# EAGLE board SmoothieBrainz - next round (EAGLE 6.4), part 1 of 2
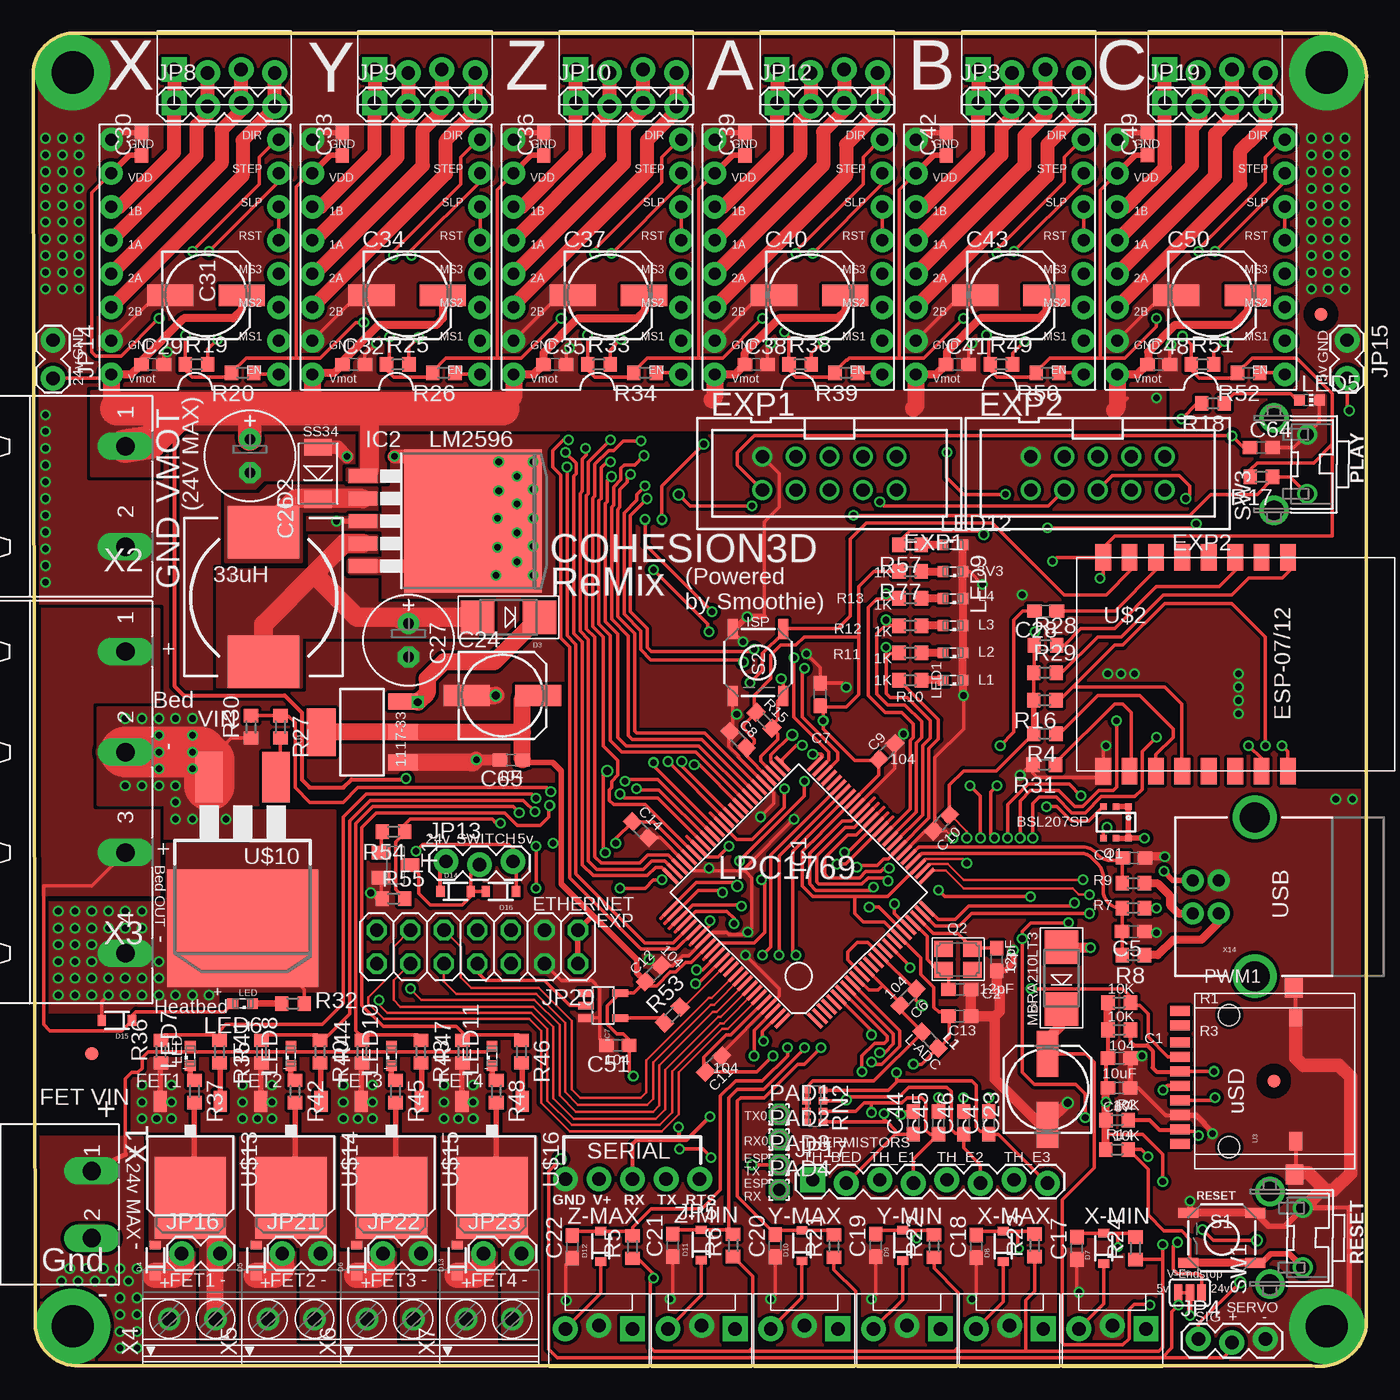
[diagram p3: board, top side]
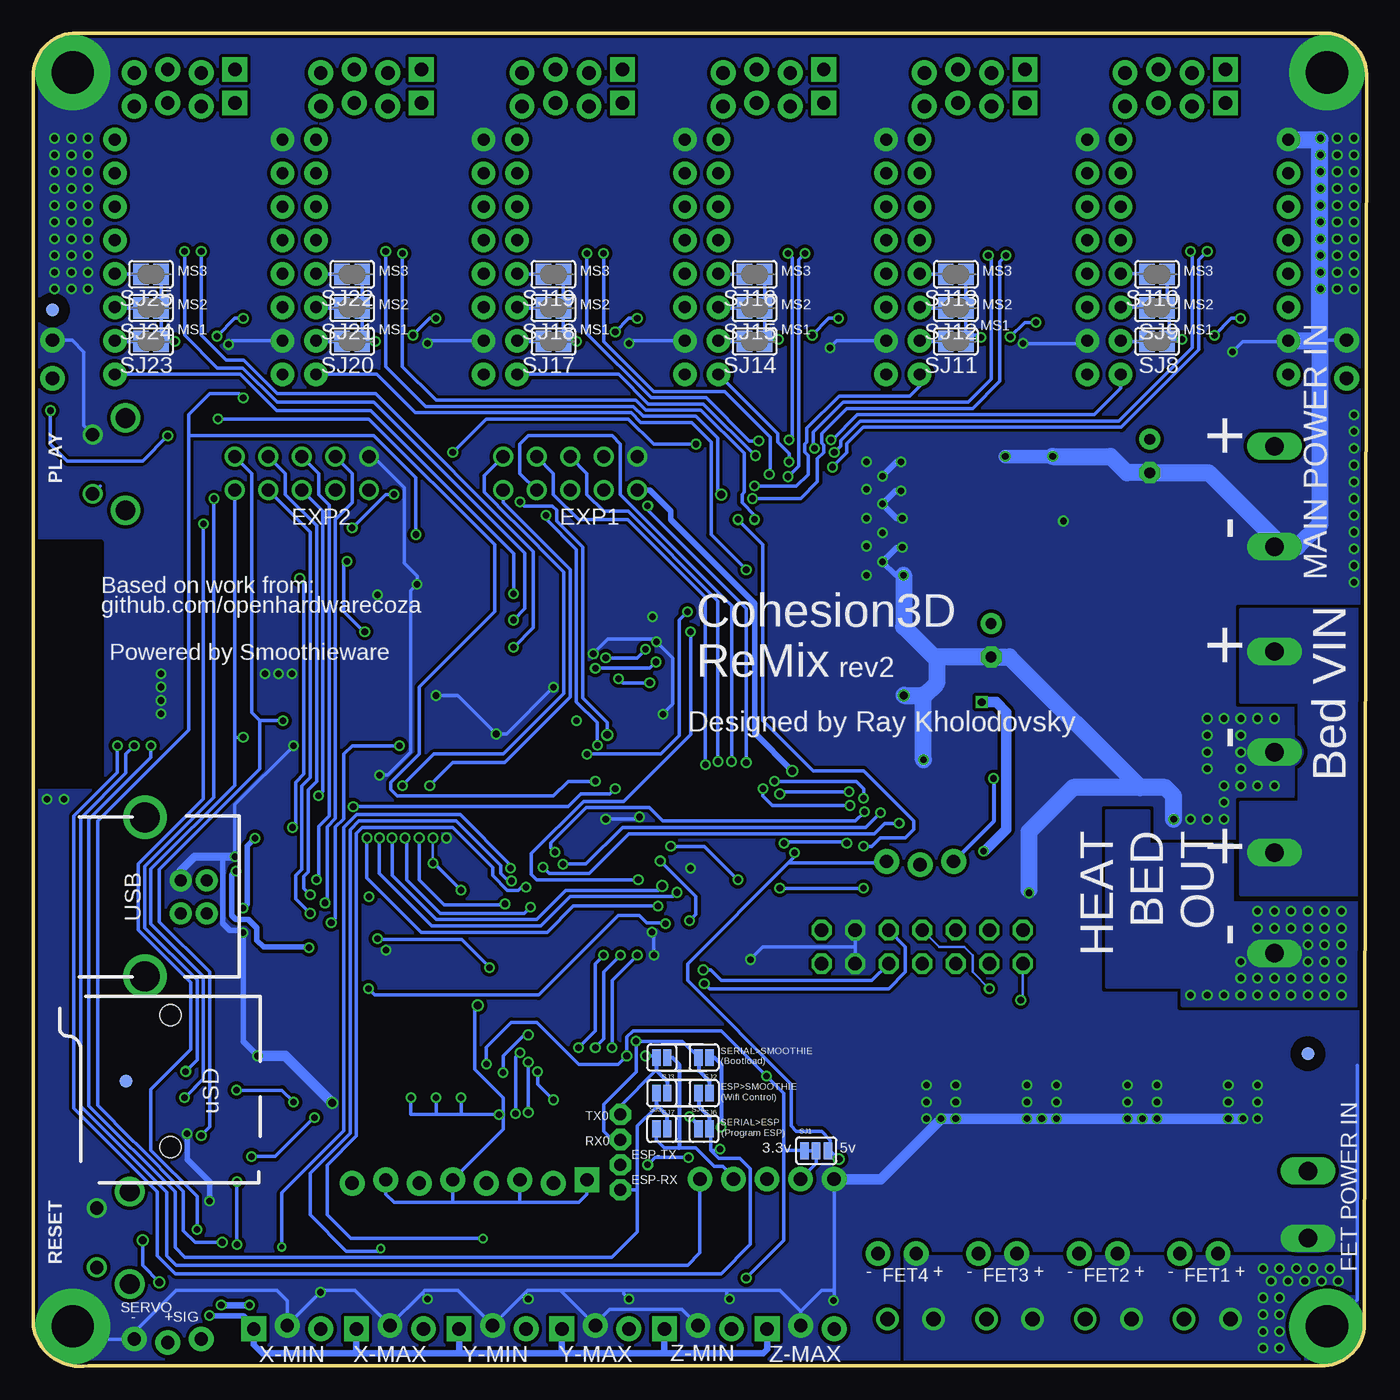
[diagram p4: board, bottom side, seen from below]

Size 101.02 x 101.05 mm. Coordinates in mm from the lower left corner, seen from the top.
Outline: 3.48,0.05 96.85,0.05 arc90 101.01,3.05 101.01,97.48 arc90 98.01,101.05 3.01,101.05 arc90 0.01,97.64 0.16,3.2 arc90 3.48,0.05
Copper layers (1*16): Top 0.035mm / dielectric 1.5mm / Bottom 0.035mm
Design rules "dirt_cheap_dirty_boards.v1 *": minimum track width 5mil, minimum drill 12mil, track to track 8mil, track to pad 5mil, pad to pad 5mil, via to via 5mil, smd to smd 0mil, copper to edge 10mil, drill to drill 10mil, minimum pad ring 10mil, minimum via ring 6mil, stop-mask expansion 2mil, vias tented up to drill 25mil, thermal gap 10mil
Net classes: 1 power: width 0.6 mm, clearance 0.305 mm; 2 ground: width 0.254 mm; 4 30-Amp Class: width 2.54 mm; 5 3.3-Amp Class: width 1.27 mm
tRestrict: area 95.9,44 to 101,62.4
bRestrict: area 95.9,44 to 101,62.4

## Footprints (pad centres in the part's own frame; a part is rotated, then mirrored left to right if it is on the bottom)
C0603 = smd 1.1 x 1: 1 -0.85,0; 2 0.85,0
153CLV-0605 = smd 3.5 x 1.6: + 2.7,0; - -2.7,0
E2,5-7 = drill 0.813 pad 1.6: + -1.27,0 | drill 0.813 pad 1.6 octagon: - 1.27,0
SMADIODE = smd 2.54 x 2.54: A 2.349,0; C -2.349,0
DO-214AC = smd 1.27 x 2.1: 1 -1.98,0; 2 1.98,0
SOD-323 = smd 0.63 x 0.83: A 1.15,0; C -1.15,0
PAK100/2500-10 = drill 1 pad 1.422: 1 -5.08,-1.27; 2 -5.08,1.27; 3 -2.54,-1.27; 4 -2.54,1.27; 5 0,-1.27; 6 0,1.27; 7 2.54,-1.27; 8 2.54,1.27; 9 5.08,-1.27; 10 5.08,1.27
LQFP100 = smd 0.27 x 1.5: 1 -6,-7.75; 2 -5.5,-7.75; 3 -5,-7.75; 4 -4.5,-7.75; 5 -4,-7.75; 6 -3.5,-7.75; 7 -3,-7.75; 8 -2.5,-7.75; 9 -2,-7.75; 10 -1.5,-7.75; 11 -1,-7.75; 12 -0.5,-7.75; 13 0,-7.75; 14 0.5,-7.75; 15 1,-7.75; 16 1.5,-7.75; 17 2,-7.75; 18 2.5,-7.75; 19 3,-7.75; 20 3.5,-7.75; 21 4,-7.75; 22 4.5,-7.75; 23 5,-7.75; 24 5.5,-7.75; 25 6,-7.75; 51 6,7.75; 52 5.5,7.75; 53 5,7.75; 54 4.5,7.75; 55 4,7.75; 56 3.5,7.75; 57 3,7.75; 58 2.5,7.75; 59 2,7.75; 60 1.5,7.75; 61 1,7.75; 62 0.5,7.75; 63 0,7.75; 64 -0.5,7.75; 65 -1,7.75; 66 -1.5,7.75; 67 -2,7.75; 68 -2.5,7.75; 69 -3,7.75; 70 -3.5,7.75; 71 -4,7.75; 72 -4.5,7.75; 73 -5,7.75; 74 -5.5,7.75; 75 -6,7.75 | smd 1.5 x 0.27: 26 7.75,-6; 27 7.75,-5.5; 28 7.75,-5; 29 7.75,-4.5; 30 7.75,-4; 31 7.75,-3.5; 32 7.75,-3; 33 7.75,-2.5; 34 7.75,-2; 35 7.75,-1.5; 36 7.75,-1; 37 7.75,-0.5; 38 7.75,0; 39 7.75,0.5; 40 7.75,1; 41 7.75,1.5; 42 7.75,2; 43 7.75,2.5; 44 7.75,3; 45 7.75,3.5; 46 7.75,4; 47 7.75,4.5; 48 7.75,5; 49 7.75,5.5; 50 7.75,6; 76 -7.75,6; 77 -7.75,5.5; 78 -7.75,5; 79 -7.75,4.5; 80 -7.75,4; 81 -7.75,3.5; 82 -7.75,3; 83 -7.75,2.5; 84 -7.75,2; 85 -7.75,1.5; 86 -7.75,1; 87 -7.75,0.5; 88 -7.75,0; 89 -7.75,-0.5; 90 -7.75,-1; 91 -7.75,-1.5; 92 -7.75,-2; 93 -7.75,-2.5; 94 -7.75,-3; 95 -7.75,-3.5; 96 -7.75,-4; 97 -7.75,-4.5; 98 -7.75,-5; 99 -7.75,-5.5; 100 -7.75,-6
TO263-5 = smd 1.067 x 2.159: 1 -3.404,-5.791; 2 -1.702,-5.791; 3 0,-5.791; 4 1.702,-5.791; 5 3.404,-5.791 | smd 10.8 x 10.41: 6 0,2.54
SOT23-5 = smd 0.55 x 1.2: 1 -0.95,-1.3; 2 0,-1.3; 3 0.95,-1.3; 4 0.95,1.3; 5 -0.95,1.3
MOLEX-1X4_LOCK = drill 1.016 pad 1.88 square: 1 0,0.127 | drill 1.016 pad 1.88: 2 2.54,-0.127; 3 5.08,0.127; 4 7.62,-0.127
1X04_LOCK = drill 1.016 pad 1.88 square: 1 0,0.127 | drill 1.016 pad 1.88: 2 2.54,-0.127; 3 5.08,0.127; 4 7.62,-0.127
1X03_LOCK = drill 1.016 pad 1.88: 1 0,0.127; 2 2.54,-0.127; 3 5.08,0.127
1X05_NO_SILK = drill 1.016 pad 1.88: 1 0,0; 2 2.54,0; 3 5.08,0; 4 7.62,0; 5 10.16,0
1X02_LOCK = drill 1.016 pad 1.88: 1 -0.178,0; 2 2.718,0
1X08_LOCK = drill 1.016 pad 1.88 square: 1 0,0.127 | drill 1.016 pad 1.88: 2 2.54,-0.127; 3 5.08,0.127; 4 7.62,-0.127; 5 10.16,0.127; 6 12.7,-0.127; 7 15.24,0.127; 8 17.78,-0.127
2X07 = drill 1.016 octagon: 1 -7.62,-1.27; 2 -7.62,1.27; 3 -5.08,-1.27; 4 -5.08,1.27; 5 -2.54,-1.27; 6 -2.54,1.27; 7 0,-1.27; 8 0,1.27; 9 2.54,-1.27; 10 2.54,1.27; 11 5.08,-1.27; 12 5.08,1.27; 13 7.62,-1.27; 14 7.62,1.27
0603 = smd 1.1 x 1: 1 -0.85,0; 2 0.85,0
CDRH125 = smd 5.4 x 4: 1 0,4.9; 2 0,-4.9
SML0603 = smd 0.8 x 0.8: A 0.75,0; C -0.75,0
CHIP-LED0603 = smd 0.8 x 0.8: A 0,-0.75; C 0,0.75
1,6/0,9 = drill 0.914 pad 1.6 octagon: 1 0,0
SC74_INFINEON = smd 0.5 x 0.5: 1 -0.95,-1.2; 2 0,-1.2; 3 0.95,-1.2; 4 0.95,1.2; 5 0,1.2; 6 -0.95,1.2
CRYSTAL_3.2X2.5 = smd 1.4 x 1.2: 1 -1.1,-0.8; 2 1.1,0.8; GND1 -1.1,0.8; GND2 1.1,-0.8
R0603 = smd 1 x 1.1: 1 -0.85,0; 2 0.85,0
0603-ARV = smd 0.5 x 0.65: 1 -1.2,-0.625; 2 -0.4,-0.625; 3 0.4,-0.625; 4 1.2,-0.625; 5 1.2,0.625; 6 0.4,0.625; 7 -0.4,0.625; 8 -1.2,0.625
TACTILE_SWITCH_SMD = smd 1.524 x 0.762: 1 -2.54,1.905; 2 2.54,1.905; 3 -2.54,-1.905; 4 2.54,-1.905
SJ_3 = smd 0.635 x 1.27: 1 -0.889,0; 2 0,0; 3 0.889,0
SJ_2S = smd 0.635 x 1.27: 1 -0.412,0; 2 0.412,0
SJ = smd 1.168 x 1.6: 1 -0.762,0; 2 0.762,0
SW_TACT_STANDARD_RIGHT_ANGLE = drill 1: 1 -2.25,0; 2 2.25,0 | drill 1.5: 3 -3.5,2.5; 4 3.5,2.5
SOT23-BEC = smd 1 x 1.4: B -0.95,-1.1; C 0,1.1; E 0.95,-1.1
SOT223 = smd 1.219 x 2.235: 1 -2.311,-3.099; 2 0,-3.099; 3 2.311,-3.099 | smd 3.6 x 2.2: 4 0,3.099
USD-SOCKET-PP = smd 0.75 x 1.5: 1 2.925,1.125; 2 1.825,1.125; 3 0.725,1.125; 4 -0.375,1.125; 5 -1.475,1.125; 6 -2.575,1.125; 7 -3.675,1.125; 8 -4.775,1.125; CD1 5.325,1.125; CD2 4.225,1.125 | smd 1.4 x 1: CDNC1 -4.55,-7.65 | smd 1.3 x 1: CDNC2 4.775,-7.65 | smd 1.5 x 1.35: GND1 -7.075,-7.55; GND2 7.075,-7.5 | hole 1.6: -5,-2.6; 5,-2.6
A4988BREAKOUT = drill 0.9 pad 1.778: 1A 8.89,1.27; 1B 11.43,1.27; 2A 6.35,1.27; 2B 3.81,1.27; DIR 16.51,-11.43; EN -1.27,-11.43; GND 16.51,1.27; GND@0 1.27,1.27; MS1 1.27,-11.43; MS2 3.81,-11.43; MS3 6.35,-11.43; RST 8.89,-11.43; SLP 11.43,-11.43; STEP 13.97,-11.43; VDD 13.97,1.27; VMOT -1.27,1.27
ESP8266-ESP12 = smd 2 x 1.2: 1 16.2,2; 2 16.2,4; 3 16.2,6; 4 16.2,8; 5 16.2,10; 6 16.2,12; 7 16.2,14; 8 16.2,16; 9 0,16; 10 0,14; 11 0,12; 12 0,10; 13 0,8; 14 0,6; 15 0,4; 16 0,2
D2PACK = smd 2.083 x 3.81: 1 -2.54,-8.89; 3 2.54,-8.89 | smd 11.43 x 8.89: 2 0,2.54
FIDUCIAL_1MM = smd 1 x 1: 1 0,0
D-PAK_TO252AA = smd 1 x 1.6: 1 -2.28,-4.8; 3 2.28,-4.8 | smd 5.4 x 6.2: 4 0,2.5
MSTBA2 = drill 1.397 long: 1 -2.54,5.08; 2 2.54,5.08
GMSTBA2 = drill 1.397 long: 1 -3.81,5.08; 2 3.81,5.08
GMSTBA4 = drill 1.397 long: 1 -11.43,5.08; 2 -3.81,5.08; 3 3.81,5.08; 4 11.43,5.08
1751248 = drill 1.1 pad 1.7: 1 -1.75,-0.1; 2 1.75,-0.1
USB-B-PTH = drill 0.914 pad 1.676: D+ 0,1.25; D- 1.981,1.25; GND 0,-1.25; VBUS 1.981,-1.25 | drill 2.286: S1 -2.718,-6.02; S2 -2.718,6.02
MOLEX-1X3_LOCK = drill 1.016 pad 1.88 square: 1 0,0.127 | drill 1.016 pad 1.88: 2 2.54,-0.127; 3 5.08,0.127

## Placement (x,y rotation side)
C1  .1uF  [C0603]  82.29,23.37 180 top
C2  12pF  [C0603]  70.2,28.57 0 top
C3  12pF  [C0603]  72.99,30.85 270 top
C4  18pF  [C0603]  83.4,38.55 180 top
C5  18pF  [C0603]  83.35,32.96 180 top
C6  .1uF  [C0603]  66.28,27.97 45 top
C7  10uF  [C0603]  59.63,50.93 90 top
C8  104  [C0603]  53.41,47.51 315 top
C9  104  [C0603]  64.67,46.6 225 top
C10  104  [C0603]  68.82,41.18 45 top
C11  .1uF  [C0603]  51.56,22.93 225 top
C12  .1uF  [C0603]  46.98,29.77 225 top
C13  104  [C0603]  70.19,26.55 180 top
C14  104  [C0603]  46.02,40.67 135 top
C17  104  [C0603]  79.07,8.97 90 top
C18  104  [C0603]  71.45,9.11 90 top
C19  104  [C0603]  63.83,9.18 90 top
C20  104  [C0603]  56.21,9.16 90 top
C21  104  [C0603]  48.47,9.19 90 top
C22  104  [C0603]  40.85,9.06 90 top
C23  100u  [153CLV-0605]  76.84,21 90 top
C24  100u  [153CLV-0605]  35.57,50.85 0 top
C26  220u  [E2,5-7]  16.43,68.99 270 top
C27  220u  [E2,5-7]  28.44,55.03 270 top
C28  104  [C0603]  76.7,57.24 180 top
C29  104  [C0603]  9.05,75.93 0 top
C30  104  [C0603]  8.21,92.63 90 top
C31  100uF  [153CLV-0605]  13.1,81.17 0 top
C32  104  [C0603]  24.29,75.93 0 top
C33  104  [C0603]  23.42,92.63 90 top
C34  100uF  [153CLV-0605]  28.34,81.17 0 top
C35  104  [C0603]  39.53,75.93 0 top
C36  104  [C0603]  38.69,92.63 90 top
C37  100uF  [153CLV-0605]  43.58,81.17 0 top
C38  104  [C0603]  54.77,75.93 0 top
C39  104  [C0603]  53.93,92.63 90 top
C40  100uF  [153CLV-0605]  58.82,81.17 0 top
C41  104  [C0603]  70.01,75.93 0 top
C42  104  [C0603]  69.17,92.63 90 top
C43  100uF  [153CLV-0605]  74.06,81.17 0 top
C44  10uF  [C0603]  66.68,18.46 90 top
C45  10uF  [C0603]  68.59,18.46 90 top
C46  10uF  [C0603]  70.49,18.46 90 top
C47  10uF  [C0603]  72.4,18.46 90 top
C48  104  [C0603]  85.25,75.93 0 top
C49  104  [C0603]  84.41,92.64 90 top
C50  100uF  [153CLV-0605]  89.3,81.17 0 top
C51  .1uF  [C0603]  44.3,24.33 180 top
C64  10uF  [C0603]  93.03,69.62 0 top
C65  .1uF  [C0603]  36.21,45.97 180 top
C67  10uF  [C0603]  82.26,21.11 180 top
D1  MBRA210LT3  [SMADIODE]  77.91,29.43 90 top
D2  [DO-214AC]  21.6,67.67 90 top
D3  MBRA210LT3  [SMADIODE]  36.02,56.77 180 top
D4  1N4148  [SOD-323]  9.28,8.05 90 top
D5  1N4148  [SOD-323]  16.9,8.05 90 top
D6  1N4148  [SOD-323]  24.52,8.05 90 top
D7  1N4148  [SOD-323]  81.11,8.95 90 top
D8  1N4148  [SOD-323]  73.49,9.11 90 top
D9  1N4148  [SOD-323]  65.87,9.18 90 top
D10  1N4148  [SOD-323]  58.25,9.16 90 top
D11  1N4148  [SOD-323]  50.63,9.21 90 top
D12  1N4148  [SOD-323]  43.01,9.11 90 top
D13  1N4148  [SOD-323]  32.14,8.05 90 top
D14  1N4148  [SOD-323]  32.01,35.99 0 top
D15  1N4148  [SOD-323]  6.36,26.24 180 top
D16  1N4148  [SOD-323]  35.44,35.99 180 top
EXP1  2510-  [PAK100/2500-10]  60.33,67.67 180 top
EXP2  2510-  [PAK100/2500-10]  80.65,67.67 180 top
IC1  LPC1769  [LQFP100]  58.01,35.93 45 top
IC2  [TO263-5]  30.78,64.06 270 top
IC7  74LVC1G04  [SOT23-5]  43.19,27.35 270 top
JP1  [MOLEX-1X4_LOCK]  71.6,98.15 0 top
JP2  [MOLEX-1X4_LOCK]  25.88,98.15 0 top
JP3  [1X04_LOCK]  71.6,95.61 0 top
JP4  [1X03_LOCK]  88.27,1.95 0 top
JP5  [1X05_NO_SILK]  50.5,14.2 180 top
JP6  [MOLEX-1X4_LOCK]  10.69,98.15 0 top
JP7  [MOLEX-1X4_LOCK]  41.12,98.15 0 top
JP8  [1X04_LOCK]  10.69,95.61 0 top
JP9  [1X04_LOCK]  25.88,95.61 0 top
JP10  [1X04_LOCK]  41.12,95.61 0 top
JP11  [MOLEX-1X4_LOCK]  56.36,98.15 0 top
JP12  [1X04_LOCK]  56.36,95.61 0 top
JP13  [1X03_LOCK]  31.28,38.15 0 top
JP14  [1X02_LOCK]  1.51,77.59 270 top
JP15  [1X02_LOCK]  99.54,77.59 270 top
JP16  [1X02_LOCK]  11.44,8.55 0 top
JP17  [1X08_LOCK]  59.06,14.02 0 top
JP18  [MOLEX-1X4_LOCK]  85.73,98.15 0 top
JP19  [1X04_LOCK]  85.73,95.61 0 top
JP20  [2X07]  33.66,31.8 180 top
JP21  [1X02_LOCK]  19.06,8.55 0 top
JP22  [1X02_LOCK]  26.68,8.55 0 top
JP23  [1X02_LOCK]  34.3,8.55 0 top
L1  39nH  [0603]  67.94,24.75 315 top
L2  33uH  [CDRH125]  17.46,58.31 0 top
LED1  [SML0603]  69.68,52 180 top
LED2  [SML0603]  69.68,54.08 180 top
LED3  [SML0603]  69.68,56.15 180 top
LED4  [SML0603]  69.68,58.19 180 top
LED5  [CHIP-LED0603]  96.68,73.23 270 top
LED6  [SML0603]  15.88,27.51 180 top
LED7  [SML0603]  11.91,23.54 90 top
LED8  LED  [SML0603]  19.53,23.54 90 top
LED9  [SML0603]  69.69,60.24 180 top
LED10  LED  [SML0603]  27.15,23.54 90 top
LED11  LED  [SML0603]  34.77,23.54 90 top
LED12  VMOT  [SML0603]  69.69,62.28 0 top
PAD1  [1,6/0,9]  56.52,19.1 0 top
PAD2  [1,6/0,9]  56.52,17.19 0 top
PAD3  [1,6/0,9]  56.52,15.29 0 top
PAD4  [1,6/0,9]  56.52,13.38 0 top
Q1  BSL207SP  [SC74_INFINEON]  82.02,41.23 180 top
Q2  12MHz  [CRYSTAL_3.2X2.5]  70.07,30.85 180 top
R1  10K  [R0603]  82.28,27.59 180 top
R2  10K  [R0603]  82.12,18.68 180 top
R3  10K  [R0603]  82.28,25.51 180 top
R4  10K  [R0603]  76.65,47.95 180 top
R5  10k  [R0603]  45.4,9.06 90 top
R6  10k  [R0603]  53.04,9.18 90 top
R7  1.5K  [R0603]  83.35,34.75 0 top
R8  33R  [R0603]  83.35,31.17 180 top
R9  33R  [R0603]  83.35,36.63 180 top
R10  [R0603]  66.44,52 180 top
R11  [R0603]  66.44,54.08 180 top
R12  [R0603]  66.44,56.15 180 top
R13  [R0603]  66.44,58.19 180 top
R14  10K  [R0603]  82.12,16.44 180 top
R15  10K  [R0603]  55.37,48.97 135 top
R16  10K  [R0603]  76.65,50.5 180 top
R17  10K  [R0603]  93.05,67.4 180 top
R18  1k  [R0603]  89.38,72.99 180 top
R19  1k  [R0603]  12.39,75.93 0 top
R20  10k  [R0603]  15.88,75.29 180 top
R21  10k  [R0603]  60.66,9.13 90 top
R22  10k  [R0603]  68.26,9.12 90 top
R23  10k  [R0603]  75.88,9.18 90 top
R24  10k  [R0603]  83.5,8.96 90 top
R25  1k  [R0603]  27.63,75.93 0 top
R26  10k  [R0603]  31.12,75.29 180 top
R27  10r  [R0603]  18.74,48.46 270 top
R28  10K  [R0603]  76.7,54.64 0 top
R29  10K  [R0603]  76.66,52.58 0 top
R30  100k  [R0603]  16.52,48.46 90 top
R31  10K  [R0603]  76.6,45.6 180 top
R32  1.5k  [R0603]  19.69,27.51 0 top
R33  1k  [R0603]  42.87,75.93 0 top
R34  10k  [R0603]  46.36,75.29 180 top
R35  10r  [R0603]  14.13,23.86 270 top
R36  100k  [R0603]  9.69,23.86 90 top
R37  1.5k  [R0603]  12.23,20.84 270 top
R38  1k  [R0603]  58.11,75.93 0 top
R39  10k  [R0603]  61.6,75.29 180 top
R40  10r  [R0603]  21.75,23.86 270 top
R41  100k  [R0603]  17.31,23.86 90 top
R42  1.5k  [R0603]  19.85,20.84 270 top
R43  10r  [R0603]  29.37,23.86 270 top
R44  100k  [R0603]  24.93,23.86 90 top
R45  1.5k  [R0603]  27.47,20.84 270 top
R46  10r  [R0603]  36.99,23.86 270 top
R47  100k  [R0603]  32.55,23.86 90 top
R48  1.5k  [R0603]  35.09,20.84 270 top
R49  1k  [R0603]  73.35,75.93 0 top
R50  10k  [R0603]  76.84,75.29 180 top
R51  1k  [R0603]  88.59,75.93 0 top
R52  10k  [R0603]  92.08,75.29 180 top
R53  22R  [R0603]  48.42,26.64 45 top
R54  10r  [R0603]  27.31,40.53 180 top
R55  100k  [R0603]  27.31,35.45 0 top
R57  1.5k  [R0603]  66.44,62.28 180 top
R77  [R0603]  66.44,60.24 180 top
RN2  4k7  [0603-ARV]  59.22,19.73 90 top
S1  [TACTILE_SWITCH_SMD]  90.05,9.76 180 top
S2  [TACTILE_SWITCH_SMD]  54.91,53.35 270 top
SJ1  [SJ_3]  41.69,16.35 0 bottom
SJ2  [SJ_2S]  50.19,23.41 180 bottom
SJ3  [SJ_2S]  53.39,23.41 180 bottom
SJ4  [SJ_2S]  50.19,18.01 0 bottom
SJ5  [SJ_2S]  53.39,18.01 0 bottom
SJ6  [SJ_2S]  50.19,20.71 180 bottom
SJ7  [SJ_2S]  53.39,20.71 180 bottom
SJ8  [SJ]  15.88,77.67 180 bottom
SJ9  [SJ]  15.88,80.21 180 bottom
SJ10  [SJ]  15.88,82.75 180 bottom
SJ11  [SJ]  31.12,77.67 180 bottom
SJ12  [SJ]  31.12,80.21 180 bottom
SJ13  [SJ]  31.12,82.75 180 bottom
SJ14  [SJ]  46.36,77.67 180 bottom
SJ15  [SJ]  46.36,80.21 180 bottom
SJ16  [SJ]  46.36,82.75 180 bottom
SJ17  [SJ]  61.6,77.67 180 bottom
SJ18  [SJ]  61.6,80.21 180 bottom
SJ19  [SJ]  61.6,82.75 180 bottom
SJ20  [SJ]  76.84,77.67 180 bottom
SJ21  [SJ]  76.84,80.21 180 bottom
SJ22  [SJ]  76.84,82.75 180 bottom
SJ23  [SJ]  92.08,77.67 180 bottom
SJ24  [SJ]  92.08,80.21 180 bottom
SJ25  [SJ]  92.08,82.75 180 bottom
SJ26  [SJ_3]  87.64,5.6 0 top
SW1  SW_TACT_4P_B  [SW_TACT_STANDARD_RIGHT_ANGLE]  96.19,9.75 90 top
SW3  SW_TACT_4P_B  [SW_TACT_STANDARD_RIGHT_ANGLE]  96.51,68.37 90 top
T1  BC817  [SOT23-BEC]  27.47,37.99 270 top
U1  [SOT223]  24.93,48.07 90 top
U3  USD-SOCKETUSD  [USD-SOCKET-PP]  88.01,21.63 90 top
U$1  POLOLU_A4983CARRIER  [A4988BREAKOUT]  7.2,76.45 90 top
U$2  ESP8266_ESP-12  [ESP8266-ESP12]  79.06,61.31 270 top
U$5  POLOLU_A4983CARRIER  [A4988BREAKOUT]  22.43,76.45 90 top
U$6  POLOLU_A4983CARRIER  [A4988BREAKOUT]  37.67,76.45 90 top
U$7  POLOLU_A4983CARRIER  [A4988BREAKOUT]  52.91,76.45 90 top
U$8  POLOLU_A4983CARRIER  [A4988BREAKOUT]  68.15,76.45 90 top
U$9  POLOLU_A4983CARRIER  [A4988BREAKOUT]  83.39,76.45 90 top
U$10  SUM120N04-1M7L-GE3  [D2PACK]  15.88,35.76 180 top
U$11  FIDUCIAL  [FIDUCIAL_1MM]  93.99,21.64 0 top
U$12  FIDUCIAL  [FIDUCIAL_1MM]  97.56,79.74 0 top
U$13  IRLR024  [D-PAK_TO252AA]  11.91,15.29 180 top
U$14  IRLR024  [D-PAK_TO252AA]  19.53,15.29 180 top
U$15  IRLR024  [D-PAK_TO252AA]  27.15,15.29 180 top
U$16  IRLR024  [D-PAK_TO252AA]  34.77,15.29 180 top
U$17  FIDUCIAL  [FIDUCIAL_1MM]  4.45,23.7 0 top
U$18  FIDUCIAL  [FIDUCIAL_1MM]  99.54,80.06 0 bottom
U$19  FIDUCIAL  [FIDUCIAL_1MM]  93.99,21.64 0 bottom
U$20  FIDUCIAL  [FIDUCIAL_1MM]  4.45,23.7 0 bottom
X1  MSTBA2  [MSTBA2]  -0.63,12.27 270 top
X2  GMSTBA2  [GMSTBA2]  1.91,65.93 270 top
X3  GMSTBA4  [GMSTBA4]  1.91,42.75 270 top
X4  1751248  [1751248]  12.07,3.7 0 top
X5  1751248  [1751248]  19.56,3.7 0 top
X6  1751248  [1751248]  27.06,3.7 0 top
X7  1751248  [1751248]  34.55,3.7 0 top
X14  USBPTH  [USB-B-PTH]  89.83,35.59 180 top
XMN  [MOLEX-1X3_LOCK]  84.3,2.98 180 top
XMX  [MOLEX-1X3_LOCK]  76.52,2.98 180 top
YMN  [MOLEX-1X3_LOCK]  68.74,2.98 180 top
YMX  [MOLEX-1X3_LOCK]  60.96,2.98 180 top
ZMN  [MOLEX-1X3_LOCK]  53.18,2.98 180 top
ZMX  [MOLEX-1X3_LOCK]  45.41,2.98 180 top

## Tracks (layer width: path | path; a pad name or v marks a point on that pad's centre or on a via)
1A1M
  Top 1.016: JP8.2 13.23,94.87
  Top 1.067: 13.23,94.87 12.39,94.03 12.39,91.8 U$1.1A | JP8.2 JP6.2
1A2M
  Top 1.067: JP2.2 JP9.2 28.42,94.85 27.63,94.06 27.63,91.64 21.33,85.34 U$5.1A
1A3M
  Top 1.016: 43.66,94.98 JP10.2
  Top 1.067: JP7.2 JP10.2 | 43.66,94.98 42.87,94.18 42.87,91.81 U$6.1A
1A$4M
  Top 1.016: 58.11,94.34 59.06,95.3 59.06,95.33 JP12.2
  Top 1.067: 58.11,94.34 58.11,91.81 U$7.1A | JP11.2 JP12.2
1A$5M
  Top 1.067: U$8.1A 73.35,91.81 73.35,93.87 74.14,94.66 JP3.2 JP1.2
1A$6M
  Top 0.254: JP19.2 88.43,95.49 88.43,94.66
  Top 1.067: JP18.2 JP19.2 | 88.43,96.6 88.43,94.66 88.43,94.5 87.79,93.87 87.79,91.01 U$9.1A
1B1M
  Top 1.067: JP6.1 JP8.1 10.69,92.01 6.56,87.88 U$1.1B
1B2M
  Top 1.067: JP2.1 JP9.1 25.88,91.96 21.8,87.88 U$5.1B
1B3M
  Top 1.067: JP7.1 JP10.1 41.12,91.96 37.04,87.88 U$6.1B
1B$4M
  Top 1.067: JP11.1 JP12.1 56.36,91.96 52.28,87.88 U$7.1B
1B$5M
  Top 1.067: JP1.1 JP3.1 71.6,91.96 67.52,87.88 U$8.1B
1B$6M
  Top 1.067: JP18.1 JP19.1 85.73,90.85 83.51,88.63 83.19,88.31 82.76,87.88 U$9.1B
2
  Top 0.254: R4.1 77.75,47.95 80.65,50.85 83.83,50.85 86.37,48.31 86.37,47.67 85.06,46.37 U$2.3
2A1M
  Top 1.016: JP8.3 15.77,95.18
  Top 1.067: U$1.2A 14.29,91.17 14.29,93.71 15.77,95.18 | JP8.3 JP6.3
2A2M
  Top 1.067: U$5.2A 21.33,82.8 29.53,91.01 29.53,93.71 30.96,95.14 JP9.3 JP2.3
2A3M
  Top 1.016: 46.04,95.14 46.04,95.58 JP10.3
  Top 1.067: 36.41,82.8 44.77,91.17 44.77,93.87 46.04,95.14 | JP7.3 JP10.3
  Top 1.27: U$6.2A 36.41,82.8
2A$4M
  Top 1.016: 59.85,93.55 61.6,95.3 61.6,95.58 JP12.3
  Top 1.067: 59.85,93.55 59.85,91.02 U$7.2A | JP11.3 JP12.3
2A$5M
  Top 1.067: U$8.2A 75.09,91.02 75.09,93.23 76.68,94.82 JP3.3 JP1.3
2A$6M
  Top 1.067: U$9.2A 89.54,90.22 89.54,93.39 90.49,94.34 90.81,94.66 JP19.3 JP18.3
  Top 1.27: U$9.2A
2B1M
  Top 1.067: 18.26,95.3 15.88,92.91 15.88,90.22 U$1.2B | JP8.4 JP6.4
  Top 1.27: JP8.4 18.31,95.41 18.42,95.3 18.26,95.3
2B2M
  Top 1.067: JP2.4 JP9.4 | 33.5,95.14 31.28,92.91 31.28,90.37 21.17,80.26 U$5.2B
  Top 1.27: JP9.4 33.5,95.14
2B3M
  Top 1.016: JP10.4 48.74,95.14
  Top 1.067: 36.4,80.41 46.52,90.53 46.52,92.91 48.74,95.14 | JP7.4 JP10.4
  Top 1.27: U$6.2B 36.4,80.41
2B$4M
  Top 1.016: 63.9,94.9 63.9,95.41
  Top 1.067: 63.9,94.9 61.6,92.6 61.6,90.22 U$7.2B | JP11.4 JP12.4 63.9,95.41
2B$5M
  Top 1.067: U$8.2B 76.84,90.22 76.84,92.6 79.22,94.98 JP3.4 JP1.4
2B$6M
  Top 1.067: U$9.2B 91.45,89.58 91.45,92.12 92.72,93.39 93.35,94.03 JP19.4 JP18.4
  Top 1.27: U$9.2B
3.3V  (via drill 0.5)
  Top 0.203: IC1.28 67.59,38.45 70.42,38.45 v70.73,38.15 | v70.73,40.05 70.73,40.55 69.5,41.78 C10.2
  Top 0.254: C13.2 69.18,26.86 | 69.18,26.86 68.59,26.86 68.23,27.23 68.23,28.73 67.23,29.73 67.23,30.95 IC1.19 64.48,33.7 62.87,33.7 62.24,34.34 62.24,35.61 | 69.18,26.86 69.41,26.63 69.41,24.93 68.71,24.23 68.59,24.19 L1.2 67.32,22.91 v66.68,22.91 | IC1.71 47.01,41.27 C14.2 | IC1.84 49.87,30.63 49.43,30.63 48.69,29.89 48.27,29.89 47.23,28.86 46.68,28.86 | 81.27,20.85 C67.2 81.13,20.93 | IC1.96 52.86,25.13 52.53,25.13 50.81,23.41 50.81,22.48 C11.2 54.83,22.33 v56.04,23.54 | C14.2 45.42,41.01 | v44.14,39.65 44.14,39.99 C14.2 | 65.28,60.24 R77.2 63.69,60.24 62.55,59.1 62.55,55.29 | 81.27,17.67 81.35,17.59 84.06,17.59 85.57,16.08 v85.57,14.02 | v47,6.71 46.76,6.47 46.76,1.47 47.07,1.16 54.22,1.16 | 54.22,1.16 54.54,1.47 54.54,6.83 R6.1 | 54.22,1.16 62.24,1.16 | 62.24,1.16 69.78,1.16 | 69.78,1.16 70.09,1.47 70.09,5.6 68.26,7.44 R22.1 | 75.21,1.16 75.21,5.02 75.88,5.69 R23.1 | 46.48,29.21 46.48,29.28 C12.2 45.52,28.3 IC7.5 43.5,27.32 43.5,25.92 44.22,25.21 44.69,25.21 45.15,24.75 C51.1 45.15,22.34 v45.47,22.02 | 45.73,29.82 45.73,29.81 46.68,28.86 | 46.68,28.86 46.6,28.86 46.36,28.62 | R16.2 75.81,50.51 R29.1 75.85,52.61 R28.1 75.85,55.65 v75.89,55.69 | 62.24,35.61 64.75,35.61 IC1.28 | 62.24,35.61 59.06,35.61 58.27,36.4 58.27,39.02 59.7,40.45 IC1.42 64.07,44.83 64.07,45.94 C9.2 64.01,45.92 62.24,45.92 59.85,48.31 v59.85,48.94 59.85,50.01 C7.1 59.73,49.97 61.6,49.97 62.55,50.92 62.55,55.29 | 37.27,45.77 C65.1 | 75.59,47.95 R4.2 72.98,45.13 70.49,45.13 69.42,44.06 C10.2 | 35.16,76.4 31.28,76.4 30.27,75.4 R26.2 29.95,74.98 27.31,74.98 26.68,75.61 26.68,75.93 R25.1 26.99,76.14 v26.99,78.02
  Top 0.254: 35.16,76.4 36.99,76.4 v40.01,79.42 | v25.06,79.1 24.45,79.1 21.75,76.4 19.94,76.4 | 19.94,76.4 16.14,76.4 R20.2 14.71,74.98 12.07,74.98 11.54,75.51 R19.1 v11.54,78.13 | 19.94,76.4 19.94,89.41 20.95,90.42 U$5.VDD | R17.2 92.2,67.95 92.72,68.47 97,68.47 98.43,69.9 | 62.24,1.16 62.31,1.24 62.31,5.68 60.66,7.34 R21.1 | v9.56,79.42 9.53,79.42 6.67,76.56 4.77,76.56 4.45,76.88 4.45,88.95 U$1.VDD | U$2.16 81.06,62.05 81.92,62.91 98.43,62.91 98.43,69.9 | U$2.16 77.54,61.31 v77.24,61.01 | U$2.16 81.06,59.96 80.84,59.74 v80.81,59.74 | Q1.4 81.07,40.55 v81.36,40.84 | 62.55,55.29 58.43,55.29 57.79,54.66 56.65,54.66 55.89,53.89 55.89,52.12 54.62,50.85 54.62,49.73 R15.2 53.83,48.62 53.83,48.33 54.63,47.53 54.63,47.23 54.3,46.9 C8.2 54.01,46.29 IC1.54 | v39.38,39.65 39.69,39.73 40.01,39.42 | v68.59,36.08 69.06,35.61 v75.57,35.61 | 46.99,6.7 v47,6.71 | v41.99,78.15 42.02,78.13 R33.1 42.02,75.51 42.55,74.98 45.19,74.98 R34.2 45.51,75.4 46.52,76.4 50.41,76.4 | 35.16,76.4 35.16,89.18 U$6.VDD | 50.41,76.4 52.23,76.4 v55.25,79.42 | v56.92,78.39 57.26,78.05 R38.1 57.16,75.83 57.16,75.61 57.79,74.98 60.97,74.98 60.75,75.19 R39.2 60.75,75.4 61.6,76.25 61.68,76.25 61.84,76.4 65.62,76.4 | 50.41,76.4 50.41,89.19 U$7.VDD | 65.62,76.4 67.47,76.4 v70.49,79.42 | 72.4,75.83 72.4,75.61 73.03,74.98 75.57,74.98 75.89,75.29 R50.2 75.99,75.4 77,76.4 80.84,76.4 | 72.4,75.83 R49.1 | 65.62,76.4 65.62,89.16 U$8.VDD | 72.4,75.83 72.4,77.99 v72.24,78.15 | 80.84,76.4 82.71,76.4 85.1,78.79 v85.1,79.42 | v87.08,78.07 87.74,77.41 R51.1 87.64,75.83 87.64,75.61 88.35,74.9 91.21,74.9 91.23,74.92 R52.2 92.34,76.4 95.73,76.4 98.43,73.71 98.43,69.9
  Top 0.254: 80.84,76.4 80.84,89.14 U$9.VDD | 69.78,1.16 75.21,1.16 | 75.21,1.16 85.25,1.16 85.57,1.47 v85.57,9.25 85.57,8.11 R24.1 | 81.41,23.33 81.44,23.33 C1.2 | v81.28,20.05 81.28,19.74 81.27,19.73 | v11.54,78.13 | v11.54,78.13 | v47,6.71 47,7.03 45.82,8.21 R5.1
  Top 0.305: 81.41,25.49 81.41,23.4 C1.2 | 81.27,20.85 81.27,20.97 81.31,21.23 81.31,23.23 81.41,23.33 | U3.4 85.93,21.26 v85.61,20.93
  Top 0.406: 81.27,18.58 R2.2 | 81.41,25.49 R3.2 | 81.41,27.56 R1.2 | R4.2 R16.2 | 42.39,34.18 45.73,30.84 45.73,29.82 C12.2 | 42.39,34.18 JP20.1 JP20.2 | 37.27,45.77 39.38,45.77 40.01,45.13 40.01,39.42 40.01,36.56 42.39,34.18 | C30.1 7.28,91.78 U$1.VDD | C33.1 22.52,91.78 U$5.VDD | C36.1 37.76,91.78 U$6.VDD | C39.1 53,91.78 U$7.VDD | C42.1 68.24,91.78 U$8.VDD | C49.1 83.49,91.79 U$9.VDD
  Top 0.61: R2.2 81.27,19.73 81.27,20.85 | R14.2 81.27,17.67 81.27,18.58 | 81.41,25.49 81.41,27.56
  Top 1.016: 36.44,48.07 37.06,48.08
  Top 1.27: C65.1 37.06,48.08 37.06,50.62 37.29,50.85 C24.+ | 36.44,48.07 U1.2 U1.4
  Bottom 0.203: v70.73,38.15 v70.73,40.05
  Bottom 0.254: SJ1.1 42.75,16.35 | 44.14,16.39 44.14,20.68 v45.47,22.02 48.9,25.45 55.57,25.45 56.04,24.97 v56.04,23.54 56.68,22.91 59.7,22.91 62.87,26.08 64.78,26.08 66.68,24.18 v66.68,22.91 | v77.24,61.01 77.48,60.77 77.48,57.2 75.97,55.69 v75.89,55.69 | v81.36,40.84 81.13,41.08 81.13,44.27 80.49,44.91 80.49,59.45 80.78,59.74 v80.81,59.74 | v70.73,38.15 70.65,38.15 v68.59,36.08 | v44.14,39.65 44.06,39.73 39.45,39.73 v39.38,39.65 | JP5.4 41.7,15.38 SJ1.2 SJ1.1 | 44.14,16.39 42.71,16.39 | 42.71,16.39 42.55,16.56 | 42.71,16.39 42.63,16.39 SJ1.1 | v85.61,20.93 82.16,20.93 v81.28,20.05 | v25.06,79.1 25.91,79.1 v26.99,78.02 | v9.56,79.42 10.24,79.42 v11.54,78.13 | v40.01,79.42 40.72,79.42 v41.99,78.15 | v55.25,79.42 55.89,79.42 v56.92,78.39 | v70.49,79.42 70.97,79.42 v72.24,78.15 | v85.1,79.42 85.73,79.42 v87.08,78.07 | v85.57,14.02 v85.57,9.25 | 44.14,16.39 44.14,9.57 v47,6.71
5V  (via drill 0.5, 0.6)
  Top 0.254: C64.1 91.72,69.62 v90.81,70.53 54.62,70.53 53.35,69.26 53.35,68.31 EXP1.10 | v29.02,39.06 29.53,39.57 36.04,39.57 36.36,39.26 JP13.3 36.59,38.04 D16.C | v39.98,15.72 39.06,14.8 39.06,1.32 39.69,0.68 85.54,0.68 | v43.34,38.94 43.19,39.1 43.19,44.81 v43.5,45.13 | 85.54,0.68 86.27,1.41 86.27,4.16 v86.76,4.65 | SJ26.1 87.56,5.6 | v84.62,4.65 84.54,4.73 83.43,4.73 83.03,4.33 83.03,2.11 82.56,1.63 78.11,1.63 77.95,1.79 77.95,12.62 80.4,15.06 80.4,23.03 79.73,23.7 C23.+ | 85.54,0.68 90.18,0.68 90.81,1.32 JP4.2 | JP15.2 99.54,72.59 v99.7,72.44 | v29.15,50.34 28.71,50.34 U1.3
  Top 0.508: SJ26.1 86.75,4.9 v86.76,4.65
  Top 0.813: 77.78,26.96 77.78,25.75 76.84,24.81 C23.+
  Top 1.27: 77.78,26.96 D1.C | D3.C 38.32,56.77 34.93,53.39 31.12,53.39 29.85,52.12 29.85,51.04 v29.15,50.34
  Bottom 0.254: SJ1.3 40.61,16.35 | 40.61,16.35 v39.98,15.72 | 40.61,16.35 40.61,17.16 41.28,17.83 43.19,17.83 43.58,18.22 43.58,21.4 51.44,29.26 51.44,30.53 43.82,38.15 | 43.82,38.15 36.49,38.15 JP13.3 | v43.34,38.94 43.34,38.62 43.82,38.15 | v99.7,72.44 99.7,69.9 98.43,68.63 92.72,68.63 v90.81,70.53
  Bottom 0.406: EXP1.10 54.3,66.4 52.71,64.82 52.71,64.18 46.36,57.83 46.36,47.99 v43.5,45.13
  Bottom 0.508: v84.62,4.65 v86.76,4.65
  Bottom 0.813: v29.15,50.34 28.07,50.34 27.31,49.58 27.31,40.69 28.94,39.06 v29.02,39.06
5VREG
  Top 1.422: D3.A 27.64,56.77 | 27.64,56.77 C27.+ | 27.64,56.77 24.56,56.77 21.6,59.74 21.6,60.37 | IC2.4 23.59,62.36 21.6,60.37 | 21.6,60.37 17.46,56.24 L2.2
  pour Top (isolate 0.406, rank 2, no thermals): 26.04,62.91 20.33,62.91 20.33,61.01 20.33,60.37 13.98,60.37 13.98,51.48 20.33,51.48 20.33,55.29 33.66,55.29 33.66,57.83 26.04,57.83
12
  Top 0.254: C28.1 81.96,57.24 85.1,60.37 85.1,61.27 U$2.14
15
  Top 0.254: R31.1 77.45,45.74 81.92,50.21 82.56,50.21 83.19,49.58 83.19,45.24 U$2.2
24V  (via drill 0.5)
  Top 0.254: 21.58,75.6 U$5.VMOT 21.16,75.29 | C32.1 23.44,76.03 | 8.26,76.25 8.26,75.98 C29.1 | SJ26.3 88.52,6.78 88.27,7.03 86.68,7.03 86.37,7.35 86.37,9.09 v86.68,9.41 | 82.87,73.39 81.92,72.44 | 46.36,81.09 C37.+ | 69.22,75.98 C41.1 | 84.46,75.98 C48.1 | JP14.2 5.62,74.88 U$1.VMOT | R57.2 65.59,62.46 66.43,63.29 71.76,63.29 v72.01,63.04
  Top 0.305: 10.71,71.87 10.71,51.57 11.44,50.85 19.06,50.85 20.36,49.54 20.36,44.46 20.96,43.86 23.5,43.86 24.14,44.5 28.2,44.5 v28.26,44.56 | D14.C 30.86,37.85 JP13.1
  Top 0.61: C34.+ 31.04,79.42 30.56,78.94 26.2,78.94 23.44,76.19 23.44,76.03 | 21.16,75.29 22.81,75.29 C32.1 | U$1.VMOT 7.46,75.18 C29.1 | C31.+ 15.8,80.06 15.17,79.42 11.44,79.42 8.26,76.25 | 46.36,81.09 46.36,80.06 45.73,79.42 41.28,79.42 38.68,76.82 C35.1 37.94,75.18 U$6.VMOT | U$7.VMOT 53.18,75.18 C38.1 53.92,76.82 56.52,79.42 60.97,79.42 61.52,79.98 C40.+ | U$8.VMOT 68.42,75.18 C41.1 | C43.+ 76.76,79.98 76.21,79.42 71.76,79.42 69.22,76.88 69.22,75.98 | U$9.VMOT 83.66,75.18 C48.1 | C50.+ 92,79.98 90.94,78.91 86.49,78.91 84.46,76.88 84.46,75.98
  Top 1.016: IC2.1 25.48,67.96
  Top 1.27: U$1.VMOT 5.93,73.02 6.36,72.59 | 20.33,72.59 21.16,73.43 U$5.VMOT | 35.57,72.59 36.4,73.43 U$6.VMOT | U$7.VMOT 51.64,73.43 51.44,73.23 | U$8.VMOT 66.88,72.79 66.68,72.59 | U$9.VMOT 82.12,72.63 81.92,72.44
  Top 1.422: 25.48,67.96 25.48,72.52 27.95,72.59
  Top 1.778: 12.78,72.52 12.71,72.59 | C26.+ 16.43,72.04 15.88,72.59
  Top 2.54: 6.36,72.59 11.44,72.59 | 11.44,72.59 12.71,72.59 15.88,72.59 20.33,72.59 27.95,72.59 35.57,72.59 | X2.1 8.9,70.05 10.71,71.87 11.44,72.59
  Bottom 0.254: v86.68,9.41 88.75,9.41 89.62,10.28 89.62,13.28 93.13,16.78 93.53,17.19 96.13,19.78 96.13,41.32 89.22,48.23 89.22,70.53 | v85.1,73.39 85.41,73.71 87.64,73.71 89.22,72.12 89.22,70.53 | v72.01,63.04 72.01,67.36 75.19,70.53 89.22,70.53
  Bottom 0.305: v28.26,44.56 28.26,41.29 JP13.1
  pour Top (isolate 0.254, no thermals): 4.45,73.86 4.45,67.51 9.53,67.51 9.53,71.01 85.73,71.01 85.73,73.86
  pour Top (isolate 0.254, rank 2, no thermals): 24.77,71.17 24.77,67.99 23.82,67.99 23.82,67.04 26.68,67.04 26.68,71.32 24.77,71.32
AGND  (via drill 0.5, 0.6)
  Top 0.254: IC1.11 61.73,30.8 61.73,31.43 62.43,32.13 63.22,32.13 IC1.15 66.78,28.58 C6.2 66.88,27.78 v67.32,27.35 | C44.2 65.94,19.31 v65.73,19.1 | C45.2 v68.59,20.37 | C46.2 v70.49,20.37 | C47.2 v72.4,20.37
  Bottom 0.254: 64.14,12.43 59.7,12.43 59.06,13.06 JP17.1 | 64.14,12.43 JP17.3 | 64.14,12.43 69.22,12.43 | 69.22,12.43 JP17.5 65.41,17.95 65.41,19.1 | 69.22,12.43 73.67,12.43 74.3,13.06 JP17.7 | 65.41,19.1 v65.73,19.1 68.59,19.1 | v68.59,20.37 68.59,19.1 | v70.49,20.37 70.49,19.1 | 70.49,19.1 68.59,19.1 | v72.4,20.37 72.4,19.1 70.49,19.1 | 65.41,19.1 65.41,20.37 67.55,22.51 67.55,27.11 v67.32,27.35
AVCC
  Top 0.254: 64.37,28.87 65.68,27.55 C6.1 65.68,27.01 L1.1 67.34,25.3 63.68,21.64 59.06,21.64 58.59,21.17 RN2.5 RN2.6 RN2.7 RN2.8 | 64.37,28.87 IC1.12 | 64.37,28.87 64.03,28.53 63.29,28.53 IC1.10
BUZZER-RRD  (via drill 0.5)
  Top 0.254: v73.03,44.02 72.55,43.54 72.55,40.33 v72.83,40.05 | v63.35,34.81 64.08,34.81 IC1.20
  Bottom 0.254: EXP1.1 66.84,67.51 66.84,66.24 64.78,64.18 64.62,64.02 60.81,60.21 60.81,51 65.41,46.4 70.65,46.4 v73.03,44.02 | v63.35,34.81 63.82,34.34 70.17,34.34 72.71,36.88 72.71,39.93 v72.83,40.05
DIR1  (via drill 0.5)
  Top 0.254: U$1.DIR 18.47,92.96 17.15,91.64 17.15,89.58 v12.07,84.5 | IC1.80 49.67,33.28 48.5,32.11 46.33,32.11 41.12,37.32 41.12,54.71 40.46,55.37 v40.46,68.15
  Bottom 0.254: v40.46,68.15 39.38,69.24 39.38,69.93 38.14,71.17 18.58,71.17 12.71,77.04 12.71,83.87 v12.07,84.5
DIR2  (via drill 0.5)
  Top 0.254: v57.63,53.7 57.63,49.21 60.26,46.58 60.26,45.97 IC1.49 | v54.62,54.34 54.46,54.18 46.84,54.18 46.52,54.5 46.52,55.92 45.25,57.19 45.25,64.5 v46.52,65.77 | U$5.DIR 33.71,92.96 32.39,91.64 32.39,89.58 27.31,84.5 v27.31,84.18
  Bottom 0.254: v27.31,84.18 27.79,83.71 27.79,74.66 29.85,72.59 39.38,72.59 41.28,70.69 41.28,69.97 41.12,69.82 41.12,69.26 41.6,68.78 41.6,67.04 42.87,65.77 v46.52,65.77 | v54.62,54.34 55.25,53.7 v57.63,53.7
DIR3  (via drill 0.5)
  Top 0.254: U$6.DIR 48.95,92.96 47.63,91.64 47.63,89.74 42.55,84.66 v42.55,84.34 | v43.82,67.43 43.5,67.12 43.5,65.53 43.34,65.37 43.34,56.45 44.3,55.5 44.3,47.67 44.93,47.04 50.44,47.04 IC1.58
  Bottom 0.254: v42.55,84.34 43.03,83.87 43.03,68.23 v43.82,67.43
DIR4  (via drill 0.5)
  Top 0.254: U$7.DIR 64.19,92.96 62.87,91.64 62.87,89.58 57.79,84.5 v57.79,84.34 | v45.25,67.59 45.01,67.36 45.01,67.01 44.46,66.46 44.46,65.11 44.3,64.95 44.3,56.82 45.57,55.55 45.57,48.15 45.73,47.99 50.9,47.99 IC1.56
  Bottom 0.254: v45.25,67.59 45.17,67.67 45.17,70.43 48.61,73.86 53.98,73.86 57.79,77.67 v57.79,84.34
DIR5  (via drill 0.5)
  Top 0.254: U$8.DIR 79.43,92.96 78.11,91.64 78.11,89.74 73.03,84.66 v73.03,84.34 | v59.06,46.4 59.7,46.4 59.77,46.32 59.77,46.19 IC1.50 | v46.36,64.18 46.36,62.28 v51.44,57.2
  Bottom 0.254: v59.06,46.4 53.47,46.4 52.08,47.8 52.08,56.56 v51.44,57.2 | v46.36,64.18 46.36,64.5 47.31,65.45 47.31,66.09 47.15,66.24 47.15,69.2 50.44,72.48 54.6,72.48 55.35,73.23 70.49,73.23 73.03,75.77 v73.03,84.34
E1-CONTROL
  Top 0.406: R37.2 12.23,13.1 U$13.4
  Top 1.27: X4.2 13.82,10.88 U$13.4
  pour Top (no thermals): 8.9,17.35 8.9,9.09 12.71,9.09 12.71,2.11 15.25,2.11 15.25,17.35
E2-CONTROL
  Top 0.406: R42.2 19.85,13.1 U$14.4
  pour Top (no thermals): 15.75,17.35 15.75,9.09 20.33,9.09 20.33,2.11 22.87,2.11 22.87,17.35
E3-CONTROL
  Top 0.406: R45.2 27.47,13.1 U$15.4
  pour Top (no thermals): 23.37,17.35 23.37,9.09 27.95,9.09 27.95,2.11 30.49,2.11 30.49,17.35
E4-CONTROL
  Top 0.406: R48.2 35.09,13.1 U$16.4
  pour Top (no thermals): 30.99,17.35 30.99,9.09 35.57,9.09 35.57,2.11 38.11,2.11 38.11,17.35
EN1  (via drill 0.5)
  Top 0.254: R20.1 16.84,75.18 U$1.EN | IC1.81 50.03,32.93 48.74,31.64 46.04,31.64 40.65,37.03 40.65,54.53 39.99,55.19 39.99,67.54 39.38,68.15 39.38,69.42 40.17,70.21 v40.57,70.21
  Bottom 0.254: v40.57,70.21 40.49,70.21 38.58,72.12 20.64,72.12 18.63,74.13 U$1.EN
EN2  (via drill 0.5)
  Top 0.254: R26.1 32.08,75.18 U$5.EN | v58.43,52.91 58.27,52.75 58.27,49.23 60.97,46.53 60.97,45.97 IC1.48 | v53.82,53.39 53.66,53.54 46.81,53.54 46.04,54.31 46.04,55.74 44.77,57 44.77,64.68 45.73,65.63 45.73,66.09 v46.36,66.72
  Bottom 0.254: U$5.EN 33.86,74.3 34.61,73.55 39.95,73.55 42.39,71.1 42.39,70.05 42.56,69.88 42.56,69.27 42.31,69.02 42.31,67.59 43.19,66.72 v46.36,66.72 | v53.82,53.39 54.3,52.91 v58.43,52.91
EN3  (via drill 0.5)
  Top 0.254: v43.74,68.55 43.47,68.55 43.03,68.1 43.03,65.77 42.87,65.61 42.87,56.27 43.74,55.4 43.74,47.43 44.61,46.56 50.21,46.56 IC1.59 | R34.1 48.99,75.29 U$6.EN
  Bottom 0.254: v43.74,68.55 43.74,69.18 44.61,70.05 44.61,70.7 U$6.EN
EN4  (via drill 0.5)
  Top 0.254: 64.29,75.13 U$7.EN 64.23,75.29 R39.1 | v46.28,69.02 45.57,68.31 44.77,68.31 44.53,68.07 44.53,67.2 43.98,66.64 43.98,65.29 43.82,65.13 43.82,56.64 45.09,55.37 45.09,47.83 45.41,47.51 50.67,47.51 IC1.57
  Bottom 0.254: U$7.EN 56.64,75.18 54.4,72.94 50.24,72.94 46.32,69.02 v46.28,69.02
EN5  (via drill 0.5)
  Top 0.254: R50.1 79.47,75.29 U$8.EN | v47,60.37 51.12,56.24 51.12,55.77 v51.2,55.69 | 50.81,30.84 51.46,31.5 IC1.85 52.06,32.11 54.62,32.11 55.41,32.91 55.41,36.64 v55.17,36.88
  Bottom 0.254: v47,60.37 49.65,63.03 49.65,70.05 51.12,71.52 54.97,71.52 55.72,72.28 72.08,72.28 74.98,75.18 U$8.EN | v51.2,55.69 51.2,47.91 56.28,42.83 59.3,42.83 63.27,38.86 63.27,37.27 62.87,36.88 v55.17,36.88
ENET_CRS  (via drill 0.5)
  Top 0.203: IC1.92 51.77,26.87 51.5,26.87 47.45,22.82 47.45,19.78 46.98,19.3 41.12,19.3 39.88,20.54 39.88,25.88 37.99,27.78 29.42,27.78 v28.58,28.62
  Bottom 0.203: JP20.7 32.39,31.8 30.49,31.8 29.85,31.16 29.85,29.89 v28.58,28.62
ENET_MDC  (via drill 0.5)
  Top 0.254: v50.17,29.02 50.38,29.02 IC1.87
  Bottom 0.254: JP20.5 34.93,31.8 34.93,29.89 36.2,28.62 49.77,28.62 v50.17,29.02
ENET_MDIO  (via drill 0.5)
  Top 0.254: IC1.86 51.82,31.14 50.73,30.05 v50.25,30.05
  Bottom 0.254: JP20.6 37.47,29.26 48.9,29.26 49.69,30.05 v50.25,30.05
ENET_REF_CLK
  Top 0.203: R53.2 49.23,27.16 IC1.88
ENET_RXD0
  Top 0.203: JP20.10 31.12,29.18 32.04,28.25 38.11,28.25 40.31,26.06 40.31,20.8 41.28,19.83 46.54,19.83 46.98,20.27 46.98,23.03 51.35,27.4 51.59,27.4 IC1.91
ENET_RXD1
  Top 0.203: JP20.9 32.39,31.8 32.39,29.49 33.18,28.7 38.3,28.7 40.8,26.2 40.8,20.98 41.44,20.35 46.04,20.35 46.46,20.76 46.46,23.19 51.19,27.92 51.41,27.92 IC1.90
ENET_TX_EN
  Top 0.203: JP20.12 27.31,29.26 27.31,27.78 27.83,27.26 37.88,27.26 39.41,25.72 39.41,20.33 40.96,18.78 47.19,18.78 47.9,19.49 47.9,22.46 51.92,26.48 52.08,26.48 IC1.93
ENET_TXD0
  Top 0.203: IC1.95 52.61,25.58 52.21,25.58 48.9,22.27 48.9,19.1 47.63,17.83 40.65,17.83 38.49,19.98 38.49,25.45 37.6,26.33 26.58,26.33 25.41,27.51 25.41,27.99 27.31,29.89 27.31,31.8 JP20.11
  Top 0.254: IC1.95
ENET_TXD1  (via drill 0.5)
  Top 0.203: IC1.94 52.32,26 52.05,26 48.42,22.38 48.42,19.25 47.47,18.3 40.8,18.3 38.96,20.14 38.96,25.56 37.75,26.78 26.85,26.78 26.2,27.43 v26.2,27.75
  Bottom 0.203: JP20.14 26.04,27.91
  Bottom 0.254: 26.04,27.91 v26.2,27.75
ESPRX  (via drill 0.5)
  Top 0.254: U$2.7 93.06,46.06 v92.08,47.04
  Bottom 0.254: v92.08,47.04 92.08,46.16 96.78,41.46 96.78,19.75 90.25,13.22 90.25,9.01 89.52,8.28 57.18,8.28 55.25,10.21 55.25,13.38 | 53.79,19.81 53.79,19.69 55.25,18.22 55.25,13.38 | PAD4.1 55.25,13.38
  Bottom 0.305: SJ5.2 52.97,19 53.79,19.81 SJ7.2
ESPTX  (via drill 0.48, 0.5)
  Top 0.254: U$2.8 95.06,46.6 v94.62,47.04 | v48.98,16.48 50.73,16.48 v51.36,15.84 | v54.46,15.29 PAD3.1
  Bottom 0.254: v94.62,47.04 94.62,45 97.92,41.7 97.92,19.57 91.6,13.25 91.6,8.38 90.25,7.03 48.9,7.03 46.68,9.25 46.68,14.97 47.47,15.76 49.06,15.76 49.69,16.4 | 49.69,16.4 49.69,17.93 | 49.69,16.4 49.06,16.4 v48.98,16.48 | v51.36,15.84 53.9,15.84 v54.46,15.29
  Bottom 0.305: SJ6.2 50.6,19.72 49.79,18.91 49.79,18.02 SJ4.2 49.69,17.93
GND  (via drill 0.5, 0.5 pad 0.25, 0.6, 3.2 pad 5.71)
  Top 0.203: C10.1 69.17,40.58 v69.7,40.05 | 52.35,23.91 52.35,23.72 C11.1
  Top 0.254: IC1.41 65.15,45.2 65.27,45.32 C9.1 65.27,47.27 v65.93,47.93 | 73.03,29.97 C3.2 | 46.34,40.07 C14.1 47.5,40.07 IC1.72 50.04,37.53 50.99,37.53 | 52.35,23.91 IC1.97 56.52,28.09 56.52,28.62 v53.98,31.16 | C67.1 83.73,21.11 | 86.86,19.03 U3.6 | v85.73,38.63 85.71,38.63 | IC1.31 67.6,40.58 C10.1 68.24,40.58 68.32,40.69 68.32,46.16 70.49,48.31 v70.49,50.85 | R30.1 15.03,47.61 14.61,47.19 | 38.29,62.58 v37.88,62.16 | 33.34,45.6 33.18,45.76 | C64.2 95.5,69.62 SW3.2 97.43,71.55 LED5.C | 42.95,26.33 42.95,24.83 C51.2 | 42.95,26.33 42.95,28.62 42.31,29.26 40.01,29.26 JP20.4 | v53.31,49.44 53.01,49.74 S2.4 53.01,48.3 C8.1 53.03,47.92 52.71,47.6 52.71,46.99 53.41,46.28 53.41,46.18 IC1.55 55.35,44.23 56.12,43.46 56.12,42.67 v55.09,41.64 | 53.01,55.73 53.01,55.69 v53.78,54.91 | T1.E 26.37,35.54 R55.1 26.02,35.45 v25.58,35.88 | C32.2 25.14,76.62 v26.04,77.52 | C34.- 24.6,81.17 U$5.GND@0 | C31.- 9.37,81.17 U$1.GND@0 | C29.2 9.9,76.62 v10.17,76.88 | 50.99,37.53 v51.2,37.75 | v58.58,54.02 59.63,52.98 C7.2 61.3,51.78 v61.6,51.48 | v46.68,30.84 47.15,30.37 C12.1 48.47,30.37 49.23,31.13 49.66,31.13 IC1.83 51.44,32.91 52.55,32.91 52.71,32.75 53.98,32.75 v54.14,32.91 54.46,33.22 54.46,37.03 53.98,37.51 | 53.98,37.51 53.96,37.53 50.99,37.53 | v74.78,44.81 75.56,45.6 R31.2 75.75,44.96 76.08,44.62 80.57,44.62 U$2.1 81.06,46.81 v81.29,47.04 | LED9.C 70.94,60.24 v71.92,59.26 | 53.98,37.51 53.98,37.83 v57.63,41.48 | 55.37,56.82 55.37,63.98 56.52,65.13 56.52,67.67 EXP1.9 | C37.- 39.84,81.17 U$6.GND@0 | C35.2 40.38,76.94 v40.65,77.2 | C40.- 55.08,81.17 U$7.GND@0 | C38.2 55.62,77.25 v55.89,77.52 | C43.- 70.32,81.17 U$8.GND@0
  Top 0.254: C41.2 70.86,77.25 v71.13,77.52 | C50.- 85.56,81.17 U$9.GND@0 | C48.2 86.1,77.33 v86.21,77.44 | IC7.3 42.88,26.4 42.95,26.33 | v40.39,5 40.34,5.05 40.34,7.7 C22.1 | C21.1 48.47,5.33 v48.27,5.13 | C20.1 56.21,5.45 v55.89,5.13 | C19.1 63.83,5.45 v63.51,5.13 | C18.1 71.45,5.45 v71.13,5.13 | C17.1 79.07,5.8 v79.24,5.62
  Top 0.305: 99.71,12.03 98.46,12.03 | U3.CDNC1 95.66,14.66 U3.GND1 | U3.CDNC2 95.66,28.56 U3.GND2 | 83.73,21.11 85.81,19.03 86.86,19.03
  Top 0.406: 70.61,51.8 LED1.C | v84.01,23.53 83.84,23.37 C1.1 83.11,23.03 C67.1 83.13,21.13 | 98.46,12.03 96.22,12.03 SW1.2 94.82,10.63 93.61,10.63 S1.3 | C3.2 73.64,30 74.27,30.63 v74.27,31.53 | v22.98,64.06 IC2.3 | v98.01,3.05 98.01,2.93 99.71,4.63 99.71,12.03 | v89.34,17.63 89.34,17.8 88.11,19.03 86.91,19.03 U3.6 | v85.11,32.88 84.27,32.88 C5.1 | U$13.3 9.63,22.8 | R41.1 17.25,22.95 U$14.3 17.25,22.8 | 24.87,22.95 U$15.3 24.87,22.8 | 32.49,22.95 U$16.3 32.49,22.8 | v87.64,12.53 87.64,11.8 S1.4 | S2.3 53.01,55.73 v54.1,56.82 55.37,56.82 | C30.2 6.44,93.48 U$1.GND | C33.2 21.68,93.48 U$5.GND | C36.2 36.92,93.48 U$6.GND | C39.2 52.16,93.48 U$7.GND | C42.2 67.4,93.48 U$8.GND | C49.2 82.65,93.49 U$9.GND
  Top 0.61: S1.3 S1.4 | 84.22,32.93 C5.1 | 85.71,38.63 84.33,38.63 C4.1 | 70.43,60.23 LED4.C LED3.C LED2.C LED1.C 70.43,50.9 v70.49,50.85 | 70.43,60.23 LED9.C | 70.43,60.23 70.43,62.27 LED12.A
  Top 0.813: 72.86,26.55 C13.1 C2.2 | C3.2 72.99,28.67 73.23,28.43 73.23,26.91 72.86,26.55 | 72.86,26.55 72.86,21.8 76.84,17.83 C23.- 76.84,18.46 v78.36,19.98 | C65.2 v33.58,45.97
  Top 1.016: IC2.5 29.91,60.66 IC2.6 37.58,64.06 | v27.38,68.96 30.78,68.96 37.45,64.52 | 37.45,64.52 v37.88,64.26 37.68,64.06 37.58,64.06 | v37.88,68.56 37.78,68.56 v36.68,67.46 36.88,67.46 v37.88,66.46 37.78,66.46 v36.68,65.36 36.68,65.3 37.45,64.52 | 37.58,64.06 v36.68,63.16 36.88,63.16 v37.88,62.16 v36.68,60.96 36.88,60.96 37.39,60.45 v37.88,59.96 | U3.CDNC2 95.66,23.38 96.21,22.83 98.91,22.83 99.81,21.93 99.81,14.63 98.51,13.33 97.91,13.33 | 97.91,13.33 97.6,13.33 96.27,12 SW1.2 | 95.66,14.66 96.58,14.66 97.91,13.33 | D2.2 23.09,69.65 v23.78,68.96 | v33.58,45.97 33.55,45.94
  Top 1.27: 33.55,45.94 33.37,45.76 33.18,45.76 U1.1 | 36.84,59.89 37.39,60.45 | C24.- v35.06,50.85
  Top 3.81: X3.2 12.71,46.56 13.34,45.92 13.34,44.02
  Bottom 0.254: v58.58,54.02 57.47,55.13 53.92,55.13 53.98,55.07 53.94,55.07 v53.78,54.91 52.55,53.68 52.55,50.21 53.31,49.45 v53.31,49.44 | v61.6,51.48 65.15,47.93 v65.93,47.93 68.84,50.85 v70.49,50.85 | ZMX.2 42.87,4.17 | 42.87,4.17 44.46,5.76 48.47,5.76 | v85.73,38.63 85.73,42.59 v81.29,47.04 | 71.54,5.54 71.33,5.76 68.86,5.76 YMN.2 63.85,5.47 | 71.54,5.54 XMX.2 76.63,5.76 79.14,5.76 79.14,5.73 v79.24,5.62 XMN.2 81.76,4.96 82.56,5.76 90.18,5.76 93.35,2.59 JP4.3 97.04,2.08 v98.01,3.05 | 61.02,5.71 61.07,5.76 63.55,5.76 63.85,5.47 | 61.02,5.71 YMX.2 58.42,3.22 57.31,4.33 51.87,4.33 ZMN.2 | 42.87,4.17 41.28,5.76 40.42,5.76 40.34,5.85 | 48.47,5.76 56.27,5.76 | 56.27,5.76 60.97,5.76 61.02,5.71 | JP5.5 40.34,5.85 | JP20.4 38.74,31.8 | 38.74,31.8 JP20.3 | 38.74,31.8 45.73,31.8 v46.68,30.84 | v53.98,31.16 53.98,32.75 v54.14,32.91 | v57.63,41.48 55.25,41.48 v55.09,41.64 | v74.78,44.81 74.14,44.81 72.4,46.56 72.4,58.78 v71.92,59.26 71.92,59.89 72.9,60.88 72.9,66.59 75.25,68.94 EXP2.9 | 5.97,77.67 9.37,77.67 v10.17,76.88 | v26.04,77.52 21.37,77.52 U$5.GND@0 | U$6.GND@0 40.12,77.72 v40.65,77.2 | U$7.GND@0 55.68,77.72 v55.89,77.52 | U$8.GND@0 70.92,77.72 v71.13,77.52 | U$9.GND@0 85.92,77.72 v86.21,77.44 | JP14.1 3.29,77.77 3.55,77.52 | JP15.1 98.05,77.77 97.16,76.88 97.16,71.28 SW3.2 | v3.01,3.05 2.72,3.05 0.72,5.05 0.72,22.83 | v25.58,35.88 25.58,36.1 25.56,36.12 | 40.34,5.85 40.34,5.05 v40.39,5 | 48.47,5.76 48.47,5.33 v48.27,5.13 | 56.27,5.76 56.27,5.51 v55.89,5.13 | v63.51,5.13 63.85,5.47 | v71.13,5.13 71.54,5.54
  Bottom 0.406: v35.28,68.56 35.58,68.56 v36.68,67.46 | v35.28,66.36 35.68,66.36 v36.68,65.36 35.58,64.26 v35.18,64.26 | v35.18,62.06 35.58,62.06 v36.68,60.96 35.68,59.96 v35.08,59.96 | v87.64,12.53 87.64,14 89.34,15.7 v89.34,17.63 | 86.66,38.63 86.66,33.58 86.11,33.03 85.26,33.03 v85.11,32.88 85.11,24.63 v84.01,23.53
  Bottom 0.61: X14.GND 89.83,37.58 88.77,38.63 86.66,38.63 v85.73,38.63
  Bottom 0.813: v84.01,23.53 v84,23.54 81.92,23.54 v78.36,19.98 | JP5.5 36.81,14.2 v32.23,18.78 v24.61,18.78 v16.99,18.78 v9.37,18.78
  Bottom 1.016: v23.78,68.96 v27.38,68.96
  Bottom 1.27: U$1.GND 3.55,92.96 3.55,77.72 | 3.55,77.72 U$1.GND@0 5.97,77.67 | 3.55,77.72 3.55,77.52 3.55,63.82 5.24,62.12 6.36,62.12 | X2.2 6.36,62.12 | 6.36,62.12 11.96,67.72 C26.- 18.15,67.72 19.39,68.96 v23.78,68.96 | 32.57,53.57 32.37,53.76 C27.- 27.05,53.76 17.15,43.86 | v33.58,45.97 33.58,50.76 | v35.08,59.96 35.08,56.07 32.57,53.57 | v14.61,41.48 14.61,43.23 15.25,43.86 17.15,43.86 | 17.15,43.86 22.23,43.86 25.56,40.53 25.56,36.12 | 32.57,53.57 32.57,51.77 33.58,50.76 | v35.06,50.85 33.66,50.85 33.58,50.76
  other vias: 98.01,98.05 8.26,21.32 10.48,21.32 10.48,18.78 8.26,20.05 15.88,21.32 18.1,21.32 18.1,18.78 15.88,20.05 23.5,21.32 25.72,21.32 25.72,18.78 23.5,20.05 31.12,21.32 33.34,21.32 33.34,18.78 31.12,18.78 6.99,49.1 8.26,49.1 9.53,49.1 10.8,49.1 10.8,41.48 12.07,41.48 13.34,41.48 6.99,44.02 8.26,44.02 9.53,44.02 10.8,44.02 9.53,47.83 12.07,49.1 12.07,46.56 12.07,45.29 9.53,46.56 9.53,45.29 12.07,47.83 10.8,42.75 3.01,98.05 18.1,20.05 15.88,18.78 8.26,18.78 10.48,20.05 23.5,18.78 25.72,20.05 31.12,20.05 33.34,20.05 96.84,93.07 98.11,93.07 99.38,93.07 96.84,91.8 98.11,91.8 99.38,91.8 0.96,93.07 2.23,93.07 3.5,93.07 0.96,91.8 2.23,91.8 3.5,91.8 96.84,90.53 98.11,90.53 99.38,90.53 96.84,89.26 98.11,89.26 99.38,89.26 96.84,87.99 98.11,87.99 99.38,87.99 96.84,86.72 98.11,86.72 99.38,86.72 96.84,85.45 98.11,85.45 99.38,85.45 96.84,84.18 98.11,84.18 99.38,84.18 96.84,82.91 98.11,82.91 99.38,82.91 96.84,81.64 98.11,81.64 99.38,81.64 0.96,90.53 2.23,90.53 3.5,90.53 0.96,89.26 2.23,89.26 3.5,89.26 0.96,87.99 2.23,87.99 3.5,87.99 0.96,86.72 2.23,86.72 3.5,86.72 0.96,85.45 2.23,85.45 3.5,85.45 0.96,84.18 2.23,84.18 3.5,84.18 0.96,82.91 2.23,82.91 3.5,82.91 0.96,81.64 2.23,81.64 3.5,81.64 0.96,69.58 0.96,68.31 0.96,67.04 0.96,65.77 0.96,64.5 0.96,63.23 0.96,61.96 0.96,60.69 0.96,59.42 0.96,70.85 0.96,72.12 83.44,52.5 82.42,52.5 81.41,52.5 91.31,52.5 74.93,58.47 91.31,51.49 91.31,50.47 91.31,49.45 98.68,42.98 99.95,42.98
  pour Bottom (isolate 0.254, rank 5, no thermals): 0.01,-1.07 101.61,-1.07 101.61,101.49 0.01,101.49
  pour Top (no thermals): 7.63,21.79 10.96,21.79 10.96,17.98 7.63,17.98
  pour Top (no thermals): 15.25,21.79 18.58,21.79 18.58,17.98 15.25,17.98
  pour Top (no thermals): 22.87,21.79 26.2,21.79 26.2,17.98 22.87,17.98
  pour Top (no thermals): 30.49,21.79 33.82,21.79 33.82,17.98 30.49,17.98
  pour Top (isolate 0.254, no thermals): 5.09,49.73 5.09,42.75 10.17,42.75 10.17,40.84 15.25,40.84 15.25,49.73
  pour Bottom (rank 3, no thermals): 5.09,48.46 5.09,43.38 10.17,43.38 10.17,48.46
  pour Top (isolate 0.254, rank 5, no thermals): 0.01,0.05 101.61,0.05 101.61,101.01 0.01,101.01
HEATBED-CONTROL  (via drill 0.5)
  Top 0.254: R32.2 20.54,28.56 U$10.2 | 2.01,28.05 v1.91,28.14 | D15.A 5.21,27.63 v5.72,28.14
  other vias: 6.99,28.14 3.18,28.14 4.45,28.14 8.26,28.14 9.53,28.14 10.8,28.14 12.07,28.14 5.72,34.49 6.99,34.49 3.18,34.49 4.45,34.49 1.91,34.49 8.26,34.49 5.72,33.22 6.99,33.22 3.18,33.22 4.45,33.22 1.91,33.22 8.26,33.22 1.91,31.95 3.18,31.95 4.45,31.95 1.91,30.68 3.18,30.68 4.45,30.68 5.72,29.41 6.99,29.41 3.18,29.41 4.45,29.41 1.91,29.41 8.26,29.41 9.53,29.41 9.53,30.68 13.34,28.14
  pour Top (isolate 0.254, no thermals): 0.64,26.87 13.98,26.87 13.98,28.46 22.87,28.46 22.87,42.11 16.52,42.11 16.52,39.57 10.17,39.57 10.17,35.13 0.64,35.13
  pour Bottom (isolate 0.406, no thermals): 0.64,27.35 13.98,27.35 13.98,28.78 19.69,28.78 19.69,42.11 16.52,42.11 16.52,39.57 10.17,39.57 10.17,35.13 0.64,35.13
HEATBEDVIN
  Top 0.254: X3.3 4.45,36.4 0.8,36.4 0.8,25.92 1.28,25.45 6.71,25.45 D15.C 7.51,26.6 7.78,26.87 14.5,26.87 LED6.A
  pour Top (isolate 0.406, rank 2, no thermals): 9.53,57.35 0.01,57.35 0.01,35.76 9.53,35.76 9.53,43.38 5.72,43.38 5.72,49.73 9.53,49.73
  pour Bottom (isolate 0.406, rank 2, no thermals): 9.53,57.35 0.01,57.35 0.01,35.76 9.53,35.76 9.53,42.75 5.09,42.75 5.09,50.37 9.53,50.37
HEATERVIN  (via drill 0.5)
  Top 0.254: 6.99,16.08 6.99,21.79 7.47,22.27 7.94,22.27 8.26,22.59 8.26,23.38 8.74,23.86 12.07,23.86 | 12.07,24.18 11.96,24.29 LED7.A 11.91,24.02 12.07,23.86 | 12.07,23.86 19.69,23.86 | LED8.A 19.58,24.29 19.69,24.18 19.69,23.86 | 19.69,23.86 27.31,23.86 | 27.31,23.86 34.34,23.86 LED11.A | LED10.A 27.15,24.02 27.31,23.86
  Top 0.406: 6.99,16.08 X1.1
  Top 1.778: JP21.1 18.88,7.49 | JP22.1 26.5,7.49 | JP23.1 34.12,7.49
  Top 1.93: 18.88,7.49 18.29,6.9 D5.C | JP16.1 11.26,7.49 10.67,6.9 D4.C | D6.C 25.02,6.9 25.91,6.9 26.5,7.49 | D13.C 32.64,6.9 33.53,6.9 34.12,7.49
  other vias: 6.59,1.39 7.86,1.39 7.86,2.66 7.86,3.93 7.86,5.2 7.86,7.43 6.59,7.43 7.23,6.47 6.59,5.2 5.32,7.43 4.05,7.43 2.78,7.43 2.15,6.47 5.96,6.47 6.59,3.93 6.59,2.66 4.69,6.47 3.42,6.47
  pour Top (isolate 0.254, rank 2, no thermals): 0.01,17.35 0.01,-0.43 38.11,-0.43 38.11,8.59 8.26,8.59 8.26,17.35
  pour Bottom (isolate 0.254, no thermals): 0.01,8.3 34.93,8.3 34.93,0.05 0.01,0.05
ISP_BOOT  (via drill 0.5)
  Top 0.254: IC1.53 55.13,45.88 55.13,46.23 56.43,47.53 56.43,47.91 R15.1 55.98,48.58 56.43,49.03 56.43,50.41 S2.2 56.82,51.97 v56.68,52.12 | U$2.15 83.19,61.18 83.19,60.37 81.29,58.47 78.11,58.47 72.65,63.93 63.12,63.93 61.9,62.7 61.9,56.86 60.97,55.93 56.86,55.93 S2.1 56.82,55.59 55.25,54.02 55.25,52.75 v54.3,51.8
  Bottom 0.254: v54.3,51.8 56.36,51.8 v56.68,52.12
LED1  (via drill 0.5)
  Top 0.254: R10.2 68.59,49.01 68.59,47.54 67.86,46.82 67.86,41.55 IC1.32 64.78,38.46 64.46,38.46 63.97,37.97 62.54,37.97 v62.39,37.83 | v35.41,41.16 35.09,41.16 34.77,41.48 28.58,41.48 28.16,41.06 R54.1 28.16,40.42 27.47,39.73 27.47,36.14 R55.2
  Bottom 0.254: v35.41,41.16 36.49,41.16 37.28,40.37 55.89,40.37 58.9,37.35 61.92,37.35 v62.39,37.83
LED2  (via drill 0.5)
  Top 0.254: IC1.33 67.39,41.8 67.39,47.06 67.95,47.62 67.95,48.94 66.2,50.69 64.93,50.69 64.62,51 64.62,53.7 | 64.62,53.7 64.93,54.02 65.53,54.02 R11.2 | 64.62,53.7 v64.62,54.5 | v88.27,84.5 88.27,84.66 93.35,89.74 93.35,91.64 94.67,92.96 U$9.DIR
  Bottom 0.254: v88.27,84.5 88.27,78.15 86.37,76.25 85.04,76.25 82.5,73.71 75.06,73.71 63.12,61.77 63.12,55.99 v64.62,54.5
LED3  (via drill 0.5)
  Top 0.254: 64.9,40.02 IC1.34 66.92,42.02 66.92,47.25 67.32,47.65 67.32,48.86 66.05,50.13 64.73,50.13 63.9,50.96 63.9,55.53 64.54,56.16 64.62,56.16 | 64.62,56.16 65.58,56.16 R12.2 | 64.62,56.16 v64.62,56.56 | U$9.STEP 94.82,89.78 v89.54,84.5
  Bottom 0.254: v89.54,84.5 89.54,78.15 87.05,75.66 85.12,75.66 82.53,73.07 75.19,73.07 63.76,61.64 63.76,57.42 v64.62,56.56
LED4  (via drill 0.5)
  Top 0.254: 64.55,40.38 IC1.35 66.44,42.25 66.44,47.43 66.68,47.67 66.68,48.7 65.81,49.58 64.54,49.58 63.27,50.85 63.27,57.51 63.9,58.15 64.62,58.15 | R52.1 94.71,75.29 U$9.EN | 64.62,58.15 65.55,58.15 R13.2 | 64.62,58.15 v64.62,58.54
  Bottom 0.254: U$9.EN 85.3,75.18 82.56,72.44 75.44,72.44 65.66,62.66 65.28,62.28 64.62,61.61 v64.62,58.54
MOSI1  (via drill 0.5)
  Top 0.254: v50.09,45.61 50.45,45.61 IC1.60
  Bottom 0.254: EXP1.3 61.6,67.67 61.6,66.09 59.7,64.18 55.96,64.18 50.09,58.31 v50.09,45.61
N$1
  Top 0.254: IC1.22 67.73,32.58 67.73,30.83 68.5,30.05 Q2.2 69.35,29.68 C2.1
N$2
  Top 0.254: IC1.23 68.18,32.83 70.03,32.83 71.17,31.69 Q2.1 71.22,31.7 C3.1
N$3
  Top 0.254: LED5.A 95.73,73.23 95.26,73.71 90.95,73.71 R18.1
N$4
  Top 0.254: D11.C 50.63,5.38 ZMN.3
N$5
  Top 0.254: D10.C 58.25,5.22 YMX.3
N$6
  Bottom 0.254: SJ8.2 18.58,77.67 U$1.MS1
N$7
  Top 0.254: D9.C 65.87,5.06 YMN.3
N$8
  Bottom 0.254: SJ9.2 16.69,80.26 U$1.MS2
N$9
  Top 1.016: 21.67,65.77 D2.1
  Top 1.422: IC2.2 21.67,65.77 19.86,65.77 17.46,63.36 L2.1
  pour Top (isolate 0.254, no thermals): 20.33,61.01 20.33,64.82 26.04,64.82 26.04,66.56 23.5,66.56 23.5,66.72 17.79,66.72 17.15,66.09 14.61,66.09 14.61,61.01
N$10
  Bottom 0.254: SJ10.2 16.69,82.8 U$1.MS3
N$11
  Top 0.254: D8.C 73.49,4.9 XMX.3
N$12
  Top 0.254: U$5.RST U$5.SLP
N$13
  Top 0.254: D7.C 81.11,4.74 XMN.3
N$14  (via drill 0.5)